# Altium schematic sheet DigitalCarrierJack.SchDoc
size A4; Organization: UltraZohm; SheetNumber: 2; SheetTotal: 15
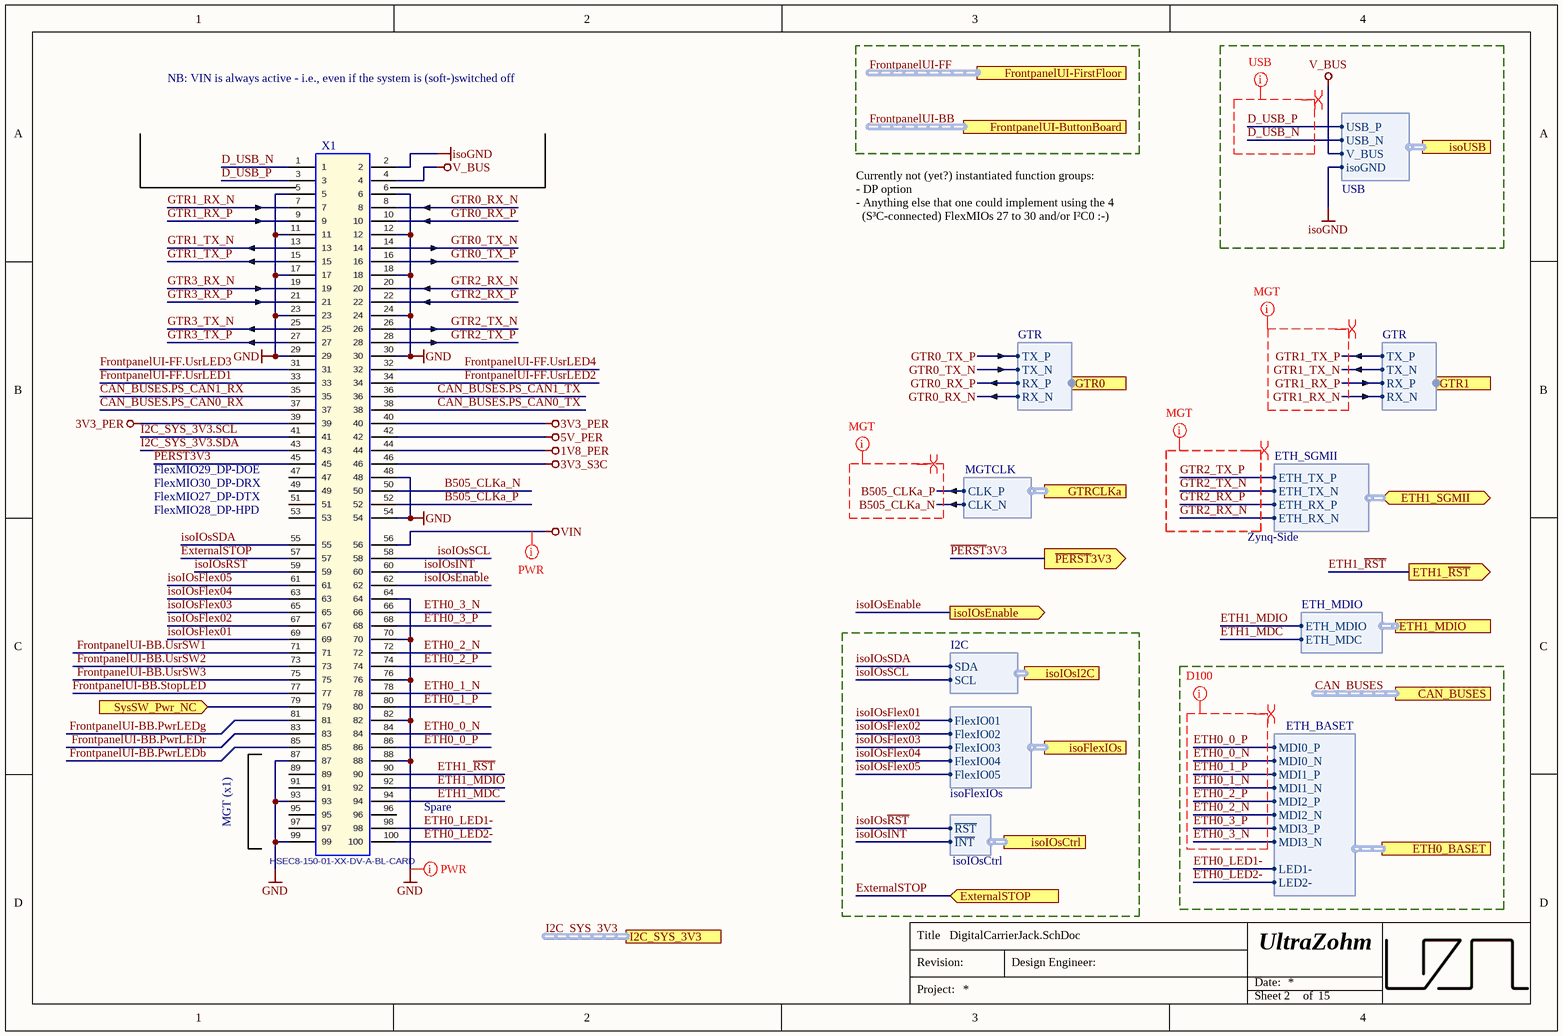
[diagram p0: DigitalCarrierJack.SchDoc]

## Parts
X1  HSEC8-150-01-XX-DV-A-BL-CARD  [HSEC8-150-01-XX-DV-A-BL-CARD]  (no BOM)

## Ports
CAN_BUSES (harness CAN_BUSES), ETH0_BASET (harness ETH_BASET), ETH1_MDIO (harness ETH_MDIO), ETH1_SGMII (bidir, harness ETH_SGMII), ETH1_~{RST} (out), ExternalSTOP (in), FrontpanelUI-ButtonBoard (harness FrontpanelUI-ButtonBoard), FrontpanelUI-FirstFloor (harness FrontpanelUI-FirstFloor), GTR0 (harness GTR), GTR1 (harness GTR), GTRCLKa (harness MGTCLK), I2C_SYS_3V3 (harness I2C), isoFlexIOs (harness isoFlexIOs), isoIOsCtrl (harness isoIOsCtrl), isoIOsEnable (out), isoIOsI2C (harness I2C), isoUSB (harness USB), SysSW_Pwr_NC (in), ~{PERST}3V3 (out)

## Harnesses
USB: USB_P, USB_N, V_BUS, isoGND
ETH_BASET: MDI0_P, MDI0_N, MDI1_P, MDI1_N, MDI2_P, MDI2_N, MDI3_P, MDI3_N, LED1-, LED2-
ETH_SGMII: ETH_RX_N, ETH_RX_P, ETH_TX_N, ETH_TX_P
ETH_MDIO: ETH_MDC, ETH_MDIO
I2C: SCL, SDA
isoFlexIOs: FlexIO01, FlexIO02, FlexIO03, FlexIO04, FlexIO05
isoIOsCtrl: ~{RST}, ~{INT}
GTR: RX_N, RX_P, TX_N, TX_P
MGTCLK: CLK_N, CLK_P

## Nets
1V8_PER: X1.44
3V3_PER: X1.39 X1.40
3V3_S3C: X1.46
5V_PER: X1.42
GND: X1.5 X1.6 X1.11 X1.12 X1.17 X1.18 X1.23 X1.24 X1.29 X1.30 X1.48 X1.54 X1.64 X1.70 X1.76 X1.82 X1.87 X1.88 X1.93 X1.99
isoGND: X1.2 ; port isoUSB.isoGND
V_BUS: X1.4 ; port isoUSB.V_BUS
VIN: X1.56
B505_CLKa_N: X1.50 ; port GTRCLKa.CLK_N
B505_CLKa_P: X1.52 ; port GTRCLKa.CLK_P
CAN_BUSES.PS_CAN0_RX: X1.37
CAN_BUSES.PS_CAN0_TX: X1.38
CAN_BUSES.PS_CAN1_RX: X1.35
CAN_BUSES.PS_CAN1_TX: X1.36
D_USB_N: X1.1 ; port isoUSB.USB_N
D_USB_P: X1.3 ; port isoUSB.USB_P
ETH0_0_N: X1.84 ; port ETH0_BASET.MDI0_N
ETH0_0_P: X1.86 ; port ETH0_BASET.MDI0_P
ETH0_1_N: X1.78 ; port ETH0_BASET.MDI1_N
ETH0_1_P: X1.80 ; port ETH0_BASET.MDI1_P
ETH0_2_N: X1.72 ; port ETH0_BASET.MDI2_N
ETH0_2_P: X1.74 ; port ETH0_BASET.MDI2_P
ETH0_3_N: X1.66 ; port ETH0_BASET.MDI3_N
ETH0_3_P: X1.68 ; port ETH0_BASET.MDI3_P
ETH0_LED1-: X1.98 ; port ETH0_BASET.LED1-
ETH0_LED2-: X1.100 ; port ETH0_BASET.LED2-
ETH1_MDC: X1.94 ; port ETH1_MDIO.ETH_MDC
ETH1_MDIO: X1.92 ; port ETH1_MDIO.ETH_MDIO
ETH1_~{RST}: X1.90 ; port ETH1_~{RST}
ExternalSTOP: X1.57 ; port ExternalSTOP
FrontpanelUI-BB.PwrLEDb: X1.85
FrontpanelUI-BB.PwrLEDg: X1.81
FrontpanelUI-BB.PwrLEDr: X1.83
FrontpanelUI-BB.StopLED: X1.77
FrontpanelUI-BB.UsrSW1: X1.71
FrontpanelUI-BB.UsrSW2: X1.73
FrontpanelUI-BB.UsrSW3: X1.75
FrontpanelUI-FF.UsrLED1: X1.33
FrontpanelUI-FF.UsrLED2: X1.34
FrontpanelUI-FF.UsrLED3: X1.31
FrontpanelUI-FF.UsrLED4: X1.32
GTR0_RX_N: X1.8 ; port GTR0.RX_N
GTR0_RX_P: X1.10 ; port GTR0.RX_P
GTR0_TX_N: X1.14 ; port GTR0.TX_N
GTR0_TX_P: X1.16 ; port GTR0.TX_P
GTR1_RX_N: X1.7 ; port GTR1.RX_N
GTR1_RX_P: X1.9 ; port GTR1.RX_P
GTR1_TX_N: X1.13 ; port GTR1.TX_N
GTR1_TX_P: X1.15 ; port GTR1.TX_P
GTR2_RX_N: X1.20 ; port ETH1_SGMII.ETH_RX_N
GTR2_RX_P: X1.22 ; port ETH1_SGMII.ETH_RX_P
GTR2_TX_N: X1.26 ; port ETH1_SGMII.ETH_TX_N
GTR2_TX_P: X1.28 ; port ETH1_SGMII.ETH_TX_P
GTR3_RX_N: X1.19
GTR3_RX_P: X1.21
GTR3_TX_N: X1.25
GTR3_TX_P: X1.27
I2C_SYS_3V3.SCL: X1.41
I2C_SYS_3V3.SDA: X1.43
isoIOsEnable: X1.62 ; port isoIOsEnable
isoIOsFlex01: X1.69 ; port isoFlexIOs.FlexIO01
isoIOsFlex02: X1.67 ; port isoFlexIOs.FlexIO02
isoIOsFlex03: X1.65 ; port isoFlexIOs.FlexIO03
isoIOsFlex04: X1.63 ; port isoFlexIOs.FlexIO04
isoIOsFlex05: X1.61 ; port isoFlexIOs.FlexIO05
isoIOs~{INT}: X1.60 ; port isoIOsCtrl.~{INT}
isoIOs~{RST}: X1.59 ; port isoIOsCtrl.~{RST}
isoIOsSCL: X1.58 ; port isoIOsI2C.SCL
isoIOsSDA: X1.55 ; port isoIOsI2C.SDA
~{PERST}3V3: X1.45 ; port ~{PERST}3V3
SysSW_Pwr_NC: X1.79 ; port SysSW_Pwr_NC

Not connected (* = marked no-connect by the designer): X1 47 49 51 53 89 91 95 96 97

## Buses and harness runs
harness CAN_BUSES = port CAN_BUSES
harness FrontpanelUI-BB = port FrontpanelUI-ButtonBoard
harness FrontpanelUI-FF = port FrontpanelUI-FirstFloor
harness I2C_SYS_3V3 = port I2C_SYS_3V3

## Layout directives
differential pair: B505_CLKa_N, B505_CLKa_P, D_USB_N, D_USB_P, ETH0_0_N, ETH0_0_P, ETH0_1_N, ETH0_1_P, ETH0_2_N, ETH0_2_P, ETH0_3_N, ETH0_3_P, GTR1_RX_N, GTR1_RX_P, GTR1_TX_N, GTR1_TX_P, GTR2_RX_N, GTR2_RX_P, GTR2_TX_N, GTR2_TX_P
net class USB: D_USB_N, D_USB_P
net class D100: ETH0_0_N, ETH0_0_P, ETH0_1_N, ETH0_1_P, ETH0_2_N, ETH0_2_P, ETH0_3_N, ETH0_3_P
net class MGT: B505_CLKa_N, B505_CLKa_P, GTR1_RX_N, GTR1_RX_P, GTR1_TX_N, GTR1_TX_P, GTR2_RX_N, GTR2_RX_P, GTR2_TX_N, GTR2_TX_P
net class PWR: GND, VIN

## Notes on the sheet
- NB: VIN is always active - i.e., even if the system is (soft-)switched off
- Currently not (yet?) instantiated function groups:
  - DP option
  - Anything else that one could implement using the 4
  (S³C-connected) FlexMIOs 27 to 30 and/or I²C0 :-)
- FlexMIO28_DP-HPD
- FlexMIO27_DP-DTX
- FlexMIO30_DP-DRX
- FlexMIO29_DP-DOE
- Zynq-Side
- MGT (x1)
- (near X1) Spare
- Title
- Revision:
- Design Engineer:
- Date:
- Project:
- Sheet
- of

## Library data of the parts
X1 = HSEC8-150-01-XX-DV-A-BL-CARD: Mating Card Layout for HSEC8-150-01-XX-DV-A-BL; Manufacturer: SAMTEC; Created: 2018_04_23_AGeiger; Value: HSEC8-150-01-XX-DV-A-BL-CARD